# Altium schematic sheet audio_main6.SchDoc: mcHF QRP Transceiver UI board
size A4; Author: K Atanassov; CompanyName: M0NKA; Revision: 0.6.3; SheetTotal: 5
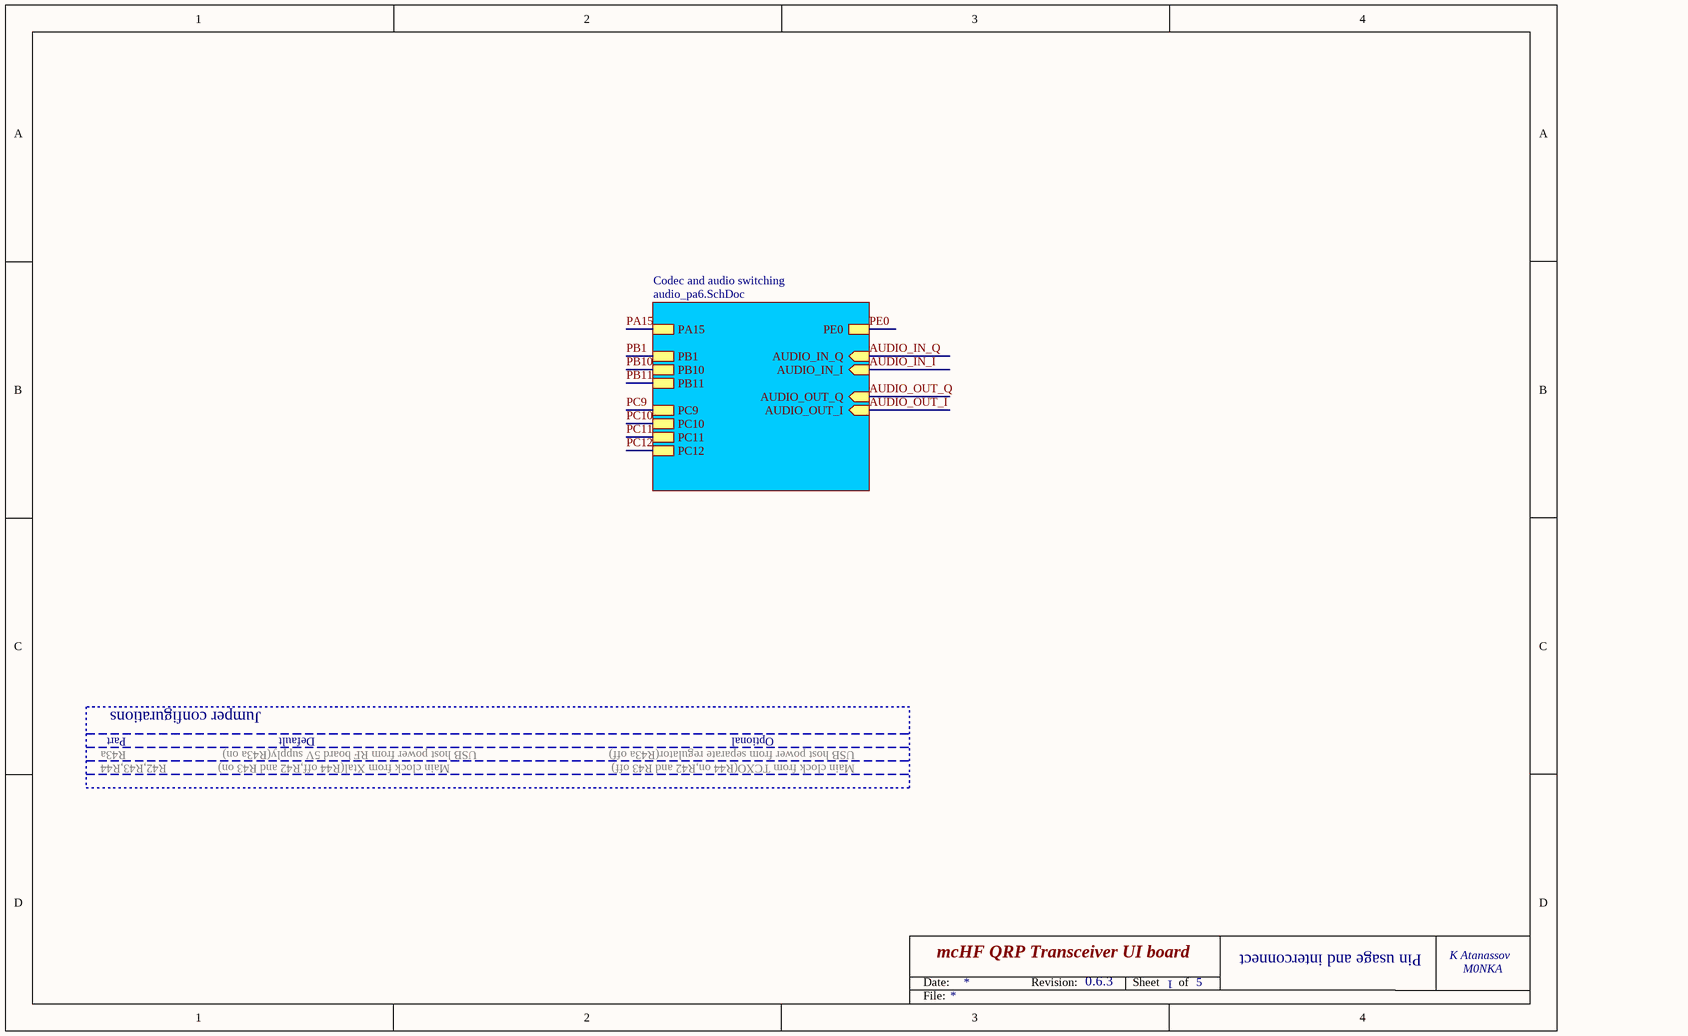
[diagram p0: audio_main6.SchDoc]

## Sub-sheets
Codec and audio switching = audio_pa6.SchDoc: PA15, PB1, PB10, PB11, PC9, PC11, PC10, PC12, PE0, AUDIO_IN_Q (in), AUDIO_IN_I (in), AUDIO_OUT_Q (in), AUDIO_OUT_I (in)

## Nets
AUDIO_IN_I: sheet Codec and audio switching/AUDIO_IN_I
AUDIO_IN_Q: sheet Codec and audio switching/AUDIO_IN_Q
AUDIO_OUT_I: sheet Codec and audio switching/AUDIO_OUT_I
AUDIO_OUT_Q: sheet Codec and audio switching/AUDIO_OUT_Q
PA15: sheet Codec and audio switching/PA15
PB1: sheet Codec and audio switching/PB1
PB10: sheet Codec and audio switching/PB10
PB11: sheet Codec and audio switching/PB11
PC9: sheet Codec and audio switching/PC9
PC10: sheet Codec and audio switching/PC10
PC11: sheet Codec and audio switching/PC11
PC12: sheet Codec and audio switching/PC12
PE0: sheet Codec and audio switching/PE0

## Notes on the sheet
- Jumper configurations
- Part
- R43a
- R42,R43,R44
- Default
- Main clock from Xtal(R44 off,R42 and R43 on)
- USB host power from RF board 5V supply(R43a on)
- Optional
- USB host power from separate regulator(R43a off)
- Main clock from TCXO(R44 on,R42 and R43 off)
- 1
- Pin usage and interconnect
- Date:
- Revision:
- Sheet
- of
- File: